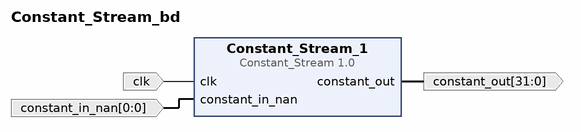
[diagram p0: block diagram of the top level]
# Vivado block design Constant_Stream_bd, xczu28dr-ffvg1517-2-e, Vivado 2024.1
create_bd_design Constant_Stream_bd

create_bd_port -dir I -type clk clk
create_bd_port -dir I -from 0 -to 0 -type data constant_in_nan
create_bd_port -dir O -from 31 -to 0 -type data constant_out

create_bd_cell -type ip -vlnv CoRSoC:VMC:Constant_Stream:1.0 Constant_Stream_1

# ---- connections ----

connect_bd_net [get_bd_pins Constant_Stream_1/constant_out] [get_bd_ports constant_out]
connect_bd_net [get_bd_ports clk] [get_bd_pins Constant_Stream_1/clk]
connect_bd_net [get_bd_ports constant_in_nan] [get_bd_pins Constant_Stream_1/constant_in_nan]

validate_bd_design
save_bd_design
